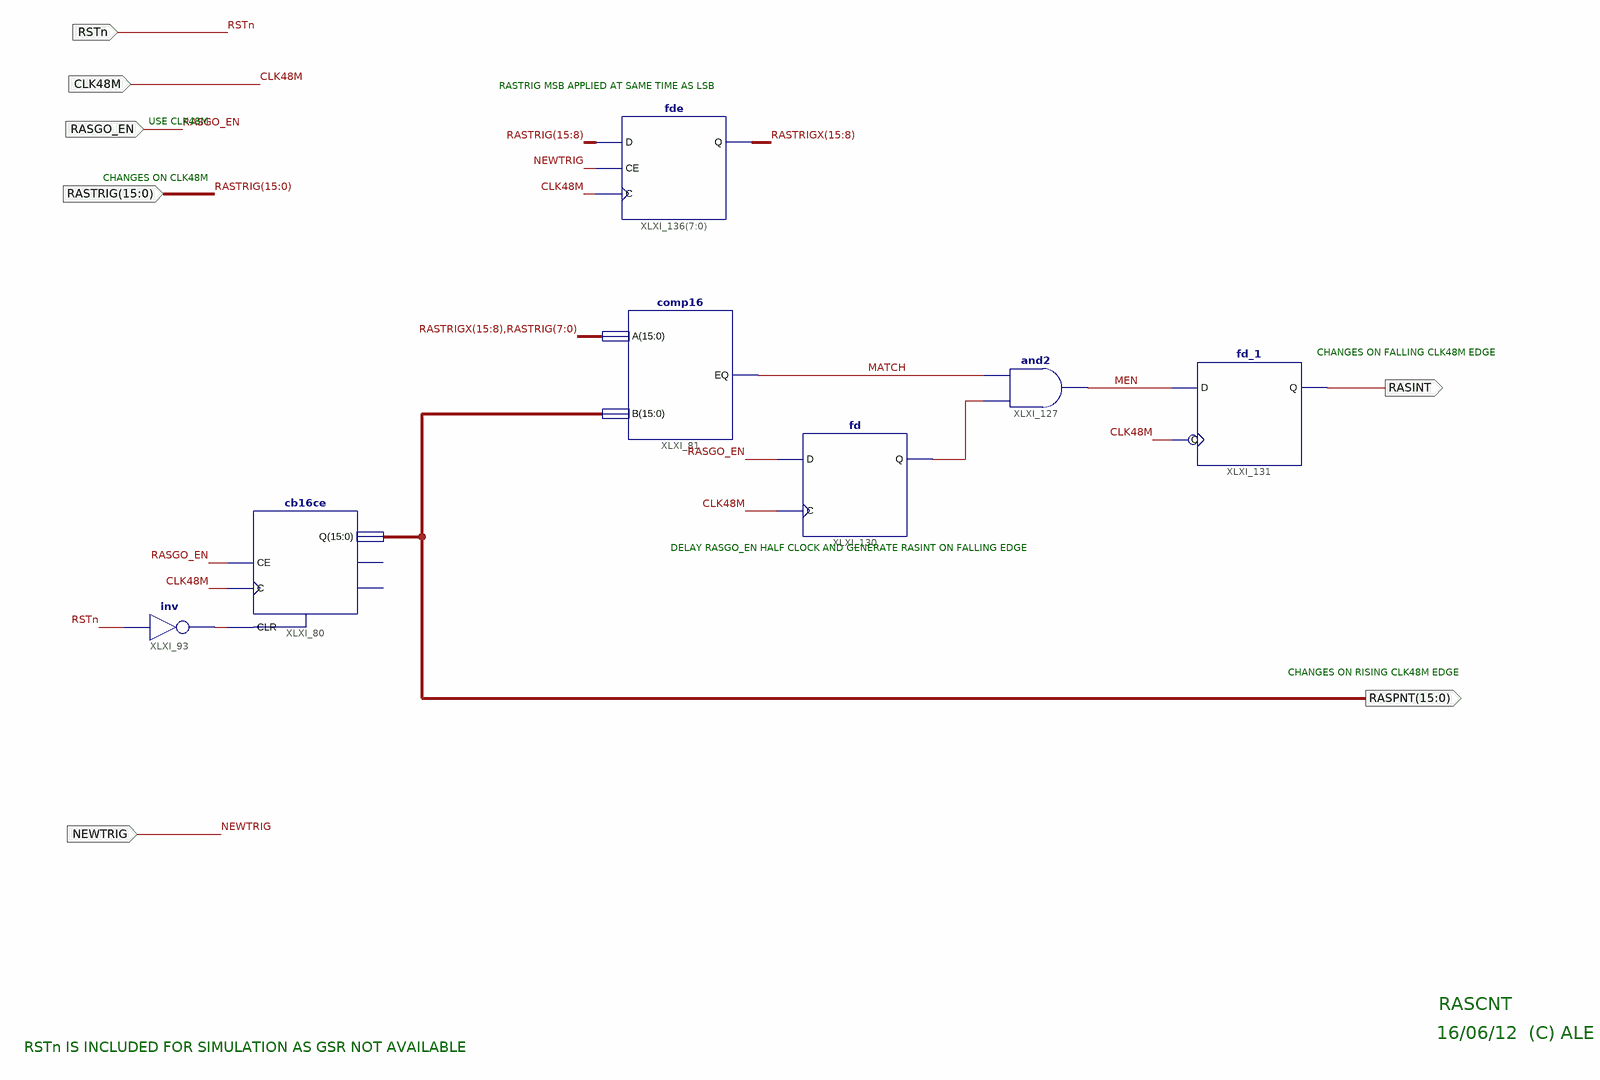
[diagram p0: schematic sheet 1]
// Xilinx ISE schematic RasCnt.sch (spartan3e) as structural Verilog: 7 symbols, 7 ports
module RasCnt (
  input  RSTn,
  input  CLK48M,
  input  RASGO_EN,
  input  NEWTRIG,
  input  [15:0] RASTRIG,
  output [15:0] RASPNT,
  output RASINT
);

  wire MATCH, MEN, XLXN_156, XLXN_228;
  wire [15:8] RASTRIGX;

  not XLXI_93 (XLXN_156, RSTn);
  cb16ce XLXI_80 (.C(CLK48M), .CE(RASGO_EN), .CLR(XLXN_156), .Q(RASPNT));  // open: CEO, TC
  and XLXI_127 (MEN, XLXN_228, MATCH);
  fd_1 XLXI_131 (.C(CLK48M), .D(MEN), .Q(RASINT));
  fd XLXI_130 (.C(CLK48M), .D(RASGO_EN), .Q(XLXN_228));
  comp16 XLXI_81 (.A({RASTRIGX, RASTRIG[7:0]}), .B(RASPNT), .EQ(MATCH));
  fde XLXI_136[7:0] (.C(CLK48M), .CE(NEWTRIG), .D(RASTRIG[15:8]), .Q(RASTRIGX));

  // Notes on the sheet:
  //   RASTRIG MSB APPLIED AT SAME TIME AS LSB
  //   USE CLK48M
  //   CHANGES ON CLK48M
  //   CHANGES ON FALLING CLK48M EDGE
  //   DELAY RASGO_EN HALF CLOCK AND GENERATE RASINT ON FALLING EDGE
  //   CHANGES ON RISING CLK48M EDGE
  //   RASCNT
  //   16/06/12  (C) ALE
  //   RSTn IS INCLUDED FOR SIMULATION AS GSR NOT AVAILABLE
endmodule
